# Altium project B100AA.PrjPcb (part 6 of 7)

## Sheet Buzzer.SchDoc: Buzzer
size A4; ApprovedBy: Mehmet Günce Akkoyun; CheckedBy: Mehmet Günce Akkoyun; Author: Mehmet Günce Akkoyun; CompanyName: Ovoo Electronics; DrawnBy: Mehmet Günce Akkoyun; Engineer: Mehmet Günce Akkoyun; Organization: Ovoo Electronics; Address1: Necip Fazıl Mah. Ortaırmak Sok.; Address2: Birgül Apt. No: 19/6; Address3: Meram / Konya; Address4: Turkiye; DocumentNumber: 48; Revision: R06; SheetNumber: 48; SheetTotal: 54
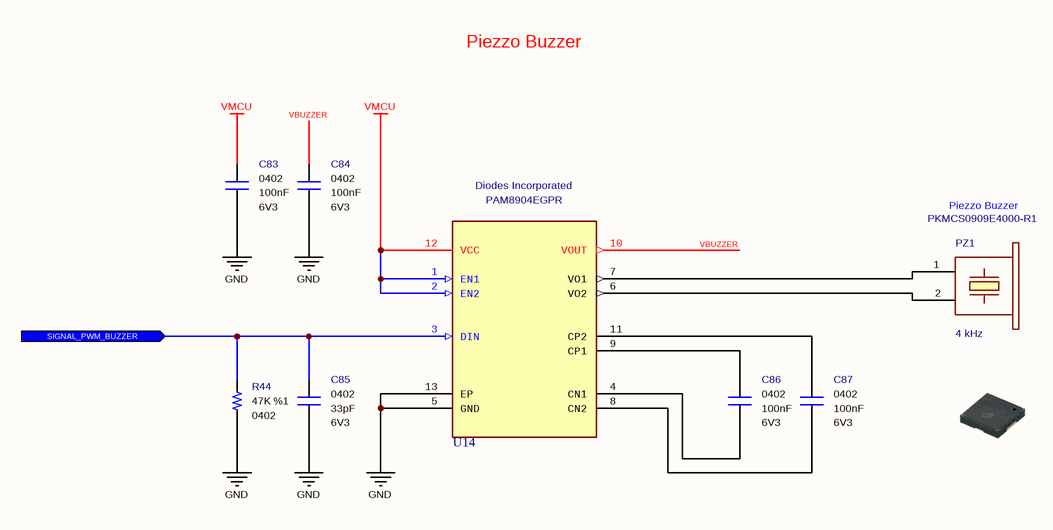
[diagram p55: Buzzer.SchDoc]

### Parts
C83  value 100nF  Case: 0402  Voltage: 6V3  [CAPACITOR_0402]  (hidden comment: Multilayer Ceramic Capacitor)
C84  value 100nF  Case: 0402  Voltage: 6V3  [CAPACITOR_0402]  (hidden comment: Multilayer Ceramic Capacitor)
C85  value 33pF  Case: 0402  Voltage: 6V3  [CAPACITOR_0402]  (hidden comment: Multilayer Ceramic Capacitor)
C86  value 100nF  Case: 0402  Voltage: 6V3  [CAPACITOR_0402]  (hidden comment: Multilayer Ceramic Capacitor)
C87  value 100nF  Case: 0402  Voltage: 6V3  [CAPACITOR_0402]  (hidden comment: Multilayer Ceramic Capacitor)
PZ1  Frequency: 4 kHz  Manufacturer Part Number: PKMCS0909E4000-R1  Device Type: Piezzo Buzzer  [Murata Piezzo Buzzer]  (hidden comment: Piezo Buzzers & Audio Indicators)
R44  value 47K  Tolerance: %1  Case: 0402  [RESISTOR_0402]  (hidden comment: Thick Film Resistor)
U14  Manufacturer Name: Diodes Incorporated  Manufacturer Part Number: PAM8904EGPR  [QFN2020-12]  (hidden comment: Audio Amplifiers)

### Ports
SIGNAL_PWM_BUZZER (in)

### Nets
GND: C83.1 C84.1 C85.1 R44.1 U14.5(GND) U14.13(EP)
VMCU: C83.2 U14.1(EN1) U14.2(EN2) U14.12(VCC)
SIGNAL_PWM_BUZZER: C85.2 R44.2 U14.3(DIN) ; port SIGNAL_PWM_BUZZER
VBUZZER: C84.2 U14.10(VOUT)
NetC86_1: C86.1 U14.4(CN1)
NetC86_2: C86.2 U14.9(CP1)
NetC87_1: C87.1 U14.8(CN2)
NetC87_2: C87.2 U14.11(CP2)
NetPZ1_1: PZ1.1(+) U14.7(VO1)
NetPZ1_2: PZ1.2(-) U14.6(VO2)

### Notes on the sheet
- Piezzo Buzzer
- Engineer
- All Rights are reserved to Customer and Engineer. [2021]
- Size:
- Date:
- A4
- Project :
- Time:
- Sheet
- of
- Customer
- Product ID
- Module ID
- Version
- File:
- Revision

### Library data of the parts
C83 C84 C86 C87 = Capacitor - 100nF [0402-6V3]: Capacitor - 100nF [0402-6V3] (Ceramic); Manufacturer Name: AVX; Manufacturer Part Number: 04026D104KAT4A; Dielectric: X5R; Tolerance: %10; Height: 0.25mm; ComponentLink1Description: Mouser; ComponentLink1URL: https://www.mouser.com.tr/ProductDetail/AVX/04026D104KAT4A?qs=sGAEpiMZZMs0AnBnWHyRQPg4iYkCw7IMED%2F4kpqgf7w%3D; ComponentLink2Description: DataSheet; ComponentLink2URL: https://www.mouser.com.tr/datasheet/2/40/cx5r-776519.pdf; ROHS: Yes; Maximum Operating Temperature: +85; Minimum Operating Temperature: -55; Supplier 1: Avnet; Supplier Part Number 1: 04026D104KAT4A; Mouser Part Number: 581-04026D104KAT4A
C85 = Capacitor - 33pF [0402-6V3]: Capacitor - 33pF [0402] (Ceramic); Manufacturer Name: Kemet; Manufacturer Part Number: C0402C330J9RACAUTO; Dielectric: X7R; Tolerance: 10%; Height: 0.5mm; Maximum Operating Temperature: +125; Minimum Operating Temperature: -55; ROHS: Yes; ComponentLink1Description: DataSheet; ComponentLink1URL: https://api.kemet.com/component-edge/download/datasheet/C0402C330J9RACAUTO.pdf; ComponentLink2Description: Mouser; ComponentLink2URL: https://www.mouser.com/Search/Refine.aspx?Keyword=80-C0402C330J9RAUTO; Supplier 1: Mouser; Supplier Part Number 1: 80-C0402C330J9RAUTO; Mouser Part Number: 80-C0402C330J9RAUTO
PZ1 = Buzzer - PKMCS0909E4000-R1: Piezo Buzzers & Audio Indicators Piezo Buzzer 9x9mm 4KHz 1.9mm Thickness; Manufacturer Name: Murata; Sound Level: 65 dBA; Height: 1.9 mm; ROHS: Yes; ComponentLink1Description: DataSheet; ComponentLink1URL: https://www.mouser.com.tr/datasheet/2/281/PKMCS0909E4000-R1-1186610.pdf; ComponentLink2Description: Mouser; ComponentLink2URL: https://www.mouser.com.tr/ProductDetail/Murata-Electronics/PKMCS0909E4000-R1/?qs=%2Fha2pyFadui1K1i3N8Z4%252B4bkKwHbQN%252BSPuj64PQSz0jmNOq7MpVIpg%3D%3D; Supplier 1: RSComponents; Supplier 2: RSComponents; Supplier 3: Mouser; Supplier 4: Arrow Electronics; Supplier 5: Farnell; Supplier 6: Newark; Supplier 7: Digi-Key; Supplier 8: Digi-Key; Supplier 9: Digi-Key; Supplier Part Number 1: 9010898P; Supplier Part Number 2: 9010898; Supplier Part Number 3: 81-PKMCS0909E4000-R1; Supplier Part Number 4: PKMCS0909E4000-R1; Supplier Part Number 5: 2529461; Supplier Part Number 6: 81Y9719; Supplier Part Number 7: 490-9647-1-ND; Supplier Part Number 8: 490-9647-6-ND; Supplier Part Number 9: 490-9647-2-ND; Mouser Part Number: 81-PKMCS0909E4000-R1; Case: SMD
R44 = Resistor - 47K: Thick Film Resistors - SMD 1/16 W 47 Kohms 1%; Manufacturer Name: Vishay; Manufacturer Part Number: CRCW040247K0FKED; Height: 0.4mm; ComponentLink1Description: DataSheet; ComponentLink1URL: https://www.mouser.com.tr/datasheet/2/427/dcrcwe3-1762152.pdf; ComponentLink2Description: Mouser; ComponentLink2URL: https://www.mouser.com.tr/ProductDetail/Vishay-Dale/CRCW040247K0FKED?qs=sGAEpiMZZMu61qfTUdNhG2DpbjADlD3GL%252B3h1elTxqU%3D; Supplier 1: Mouser; Supplier 2: Digi-Key; Supplier Part Number 1: 71-CRCW040247K0FKEDH; Supplier Part Number 2: 541-47.0KYCT-ND; Mouser Part Number: 71-CRCW0402-47K-E3
U14 = IC - PAM8904EGPR: Audio Amplifiers Audio High Volt; Operating Supply Voltage: 1V5-5V5; ComponentLink1Description: DataSheet; ComponentLink1URL: https://www.diodes.com/assets/Datasheets/PAM8904E.pdf; ComponentLink2Description: Mouser; ComponentLink2URL: https://www.mouser.com.tr/ProductDetail/Diodes-Incorporated/PAM8904EGPR/?qs=EBDBlbfErPxEsxcCuoWH6w%3D%3D; Case: VQFN2020-12; Maximum Operating Temperature: +85; Minimum Operating Temperature: -40; Supplier 1: Avnet; Supplier 2: Mouser; Supplier 3: RSComponents; Supplier 4: Digi-Key; Supplier 5: Digi-Key; Supplier Part Number 1: PAM8904EGPR; Supplier Part Number 2: 621-PAM8904EGPR; Supplier Part Number 3: 2060051; Supplier Part Number 4: 31-PAM8904EGPRCT-ND; Supplier Part Number 5: 31-PAM8904EGPRDKR-ND; Mouser Part Number: 621-PAM8904EGPR

## Sheet Master MicroController LED.SchDoc: Master MicroController LED
size A4; ApprovedBy: Mehmet Günce Akkoyun; CheckedBy: Mehmet Günce Akkoyun; Author: Mehmet Günce Akkoyun; CompanyName: Ovoo Electronics; DrawnBy: Mehmet Günce Akkoyun; Engineer: Mehmet Günce Akkoyun; Organization: Ovoo Electronics; Address1: Necip Fazıl Mah. Ortaırmak Sok.; Address2: Birgül Apt. No: 19/6; Address3: Meram / Konya; Address4: Turkiye; DocumentNumber: 28; Revision: R06; SheetNumber: 28; SheetTotal: 54
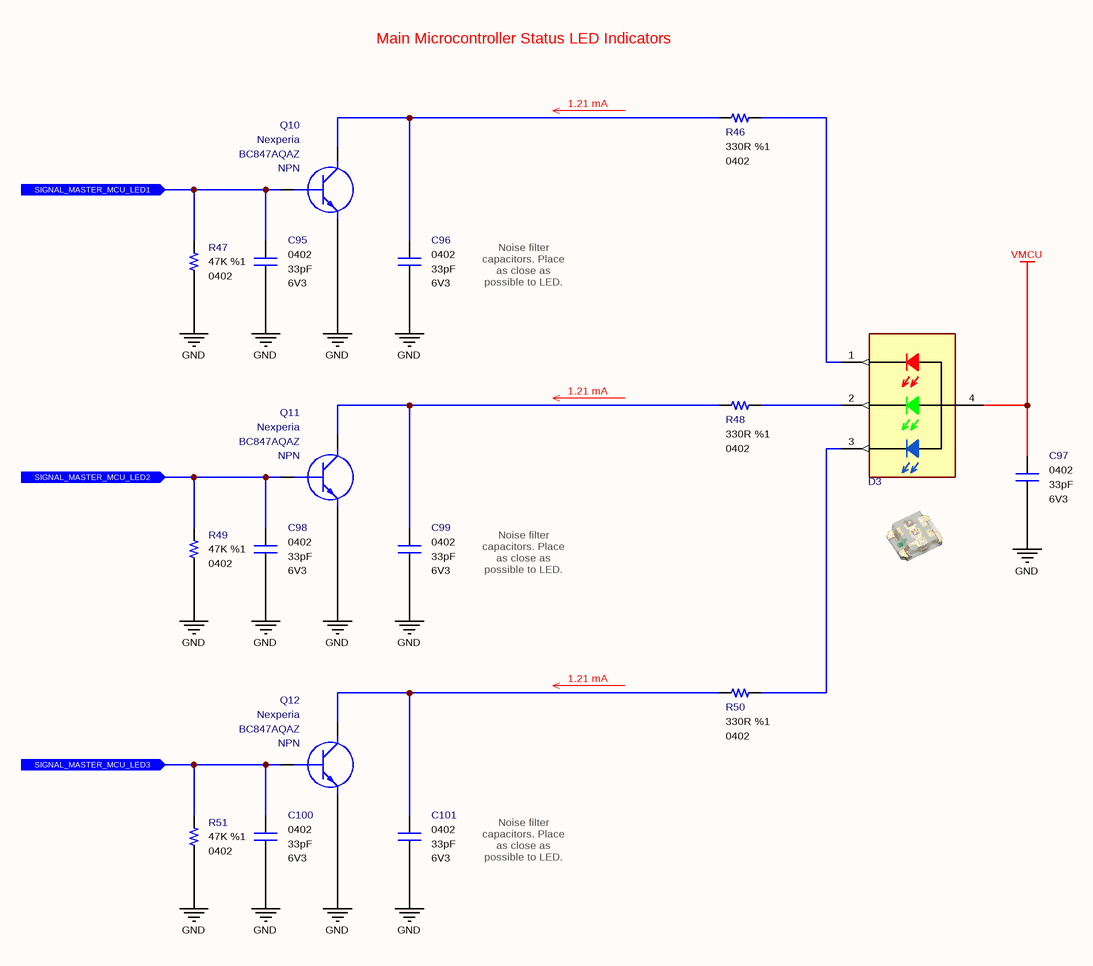
[diagram p56: Master MicroController LED.SchDoc]

### Parts
C95  value 33pF  Case: 0402  Voltage: 6V3  [CAPACITOR_0402]  (hidden comment: Multilayer Ceramic Capacitor)
C96  value 33pF  Case: 0402  Voltage: 6V3  [CAPACITOR_0402]  (hidden comment: Multilayer Ceramic Capacitor)
C97  value 33pF  Case: 0402  Voltage: 6V3  [CAPACITOR_0402]  (hidden comment: Multilayer Ceramic Capacitor)
C98  value 33pF  Case: 0402  Voltage: 6V3  [CAPACITOR_0402]  (hidden comment: Multilayer Ceramic Capacitor)
C99  value 33pF  Case: 0402  Voltage: 6V3  [CAPACITOR_0402]  (hidden comment: Multilayer Ceramic Capacitor)
C100  value 33pF  Case: 0402  Voltage: 6V3  [CAPACITOR_0402]  (hidden comment: Multilayer Ceramic Capacitor)
C101  value 33pF  Case: 0402  Voltage: 6V3  [CAPACITOR_0402]  (hidden comment: Multilayer Ceramic Capacitor)
D3  150066M153000  [Wurth_0606]  (value not drawn)
Q10  Manufacturer_Name: Nexperia  Manufacturer_Part_Number: BC847AQAZ  Polarity: NPN  [SOT1215]  (hidden comment: Bipolar NPN Transistors)
Q11  Manufacturer_Name: Nexperia  Manufacturer_Part_Number: BC847AQAZ  Polarity: NPN  [SOT1215]  (hidden comment: Bipolar NPN Transistors)
Q12  Manufacturer_Name: Nexperia  Manufacturer_Part_Number: BC847AQAZ  Polarity: NPN  [SOT1215]  (hidden comment: Bipolar NPN Transistors)
R46  value 330R  Tolerance: %1  Case: 0402  [RESISTOR_0402]  (hidden comment: Thick Film Resistor)
R47  value 47K  Tolerance: %1  Case: 0402  [RESISTOR_0402]  (hidden comment: Thick Film Resistor)
R48  value 330R  Tolerance: %1  Case: 0402  [RESISTOR_0402]  (hidden comment: Thick Film Resistor)
R49  value 47K  Tolerance: %1  Case: 0402  [RESISTOR_0402]  (hidden comment: Thick Film Resistor)
R50  value 330R  Tolerance: %1  Case: 0402  [RESISTOR_0402]  (hidden comment: Thick Film Resistor)
R51  value 47K  Tolerance: %1  Case: 0402  [RESISTOR_0402]  (hidden comment: Thick Film Resistor)

### Ports
SIGNAL_MASTER_MCU_LED1 (in), SIGNAL_MASTER_MCU_LED2 (in), SIGNAL_MASTER_MCU_LED3 (in)

### Nets
GND: C95.2 C96.2 C97.2 C98.2 C99.2 C100.2 C101.2 Q10.2(E) Q11.2(E) Q12.2(E) R47.1 R49.1 R51.1
VMCU: C97.1 D3.4
SIGNAL_MASTER_MCU_LED1: C95.1 Q10.1(B) R47.2 ; port SIGNAL_MASTER_MCU_LED1
SIGNAL_MASTER_MCU_LED2: C98.1 Q11.1(B) R49.2 ; port SIGNAL_MASTER_MCU_LED2
SIGNAL_MASTER_MCU_LED3: C100.1 Q12.1(B) R51.2 ; port SIGNAL_MASTER_MCU_LED3
NetC96_1: C96.1 Q10.3(C) R46.1
NetC99_1: C99.1 Q11.3(C) R48.1
NetC101_1: C101.1 Q12.3(C) R50.1
NetD3_1: D3.1 R46.2
NetD3_2: D3.2 R48.2
NetD3_3: D3.3 R50.2

### Notes on the sheet
- Main Microcontroller Status LED Indicators
- 1.21 mA
- Noise filter capacitors. Place as close as possible to LED.
- Engineer
- All Rights are reserved to Customer and Engineer. [2021]
- Size:
- Date:
- A4
- Project :
- Time:
- Sheet
- of
- Customer
- Product ID
- Module ID
- Version
- File:
- Revision

### Library data of the parts
C95-C101 = Capacitor - 33pF [0402-6V3]: as C85 on sheet Buzzer; Height: 0.5mm; Maximum Operating Temperature: +125; Minimum Operating Temperature: -55; ROHS: Yes; ComponentLink1Description: DataSheet; ComponentLink1URL: https://api.kemet.com/component-edge/download/datasheet/C0402C330J9RACAUTO.pdf; ComponentLink2Description: Mouser; ComponentLink2URL: https://www.mouser.com/Search/Refine.aspx?Keyword=80-C0402C330J9RAUTO; Supplier 1: Mouser; Supplier Part Number 1: 80-C0402C330J9RAUTO; Mouser Part Number: 80-C0402C330J9RAUTO
D3 = Diode - RGB LED (150066M153000): Standard LEDs - SMD PICOLED series Red LED; Manufacturer Name: Wurth Elektronik; Datasheet Link: https://www.mouser.com.tr/datasheet/2/445/150066M153000-1715259.pdf; Manufacturer Part Number: 150066M153000; Mouser Part Number: 710-150066M153000; Mouser Price/Stock: https://www.mouser.com.tr/ProductDetail/ROHM-Semiconductor/SML-P12U2TT86R?qs=sGAEpiMZZMseGfSY3csMkRIBDsfU3UCXJTULB5gem9Ta%252Bp%252BvZ709fg%3D%3D; Case: 0606; ROHS: Yes; Supplier 1: RSComponents; Supplier 2: RSComponents; Supplier 3: Mouser; Supplier 4: Farnell; Supplier 5: Digi-Key; Supplier 6: Digi-Key; Supplier 7: Digi-Key; Supplier 8: Newark; Supplier Part Number 1: 1765006; Supplier Part Number 2: 1766050; Supplier Part Number 3: 710-150066M153000; Supplier Part Number 4: 2764964; Supplier Part Number 5: 732-11390-1-ND; Supplier Part Number 6: 732-11390-6-ND; Supplier Part Number 7: 732-11390-2-ND; Supplier Part Number 8: 22AC3253
Q10-Q12 = Transistor - BC847: Bipolar Transistors - BJT BC847AQA/DFN1010D-3/REEL 7" Q2; Mouser_Part_Number: 771-BC847AQAZ; ComponentLink1Description: DataSheet; ComponentLink1URL: https://www.mouser.com.tr/datasheet/2/916/BC847XQA_SER-1598405.pdf; ComponentLink2Description: Mouser; ComponentLink2URL: https://www.mouser.com.tr/ProductDetail/Nexperia/BC847AQAZ?qs=%2Fha2pyFaduhKMCPKNtQimeJpXTw9z4AqURd2YARs8DVICZNv3AT9Dw%3D%3D; Case: DFN-1010D-3; Supplier 1: Mouser; Supplier 2: Digi-Key; Supplier Part Number 1: 771-BC847AQAZ; Supplier Part Number 2: 1727-2545-1-ND
R46 R48 R50 = Resistor - 330R: Thick Film Resistors - SMD 1/16 W 330 Ohm 1%; Manufacturer Name: Vishay; Manufacturer Part Number: CRCW0402330RFKED; Height: 0.4mm; ComponentLink1Description: DataSheet; ComponentLink1URL: https://www.mouser.com.tr/datasheet/2/427/dcrcwe3-1762152.pdf; ComponentLink2Description: Mouser; ComponentLink2URL: https://www.mouser.com.tr/ProductDetail/Vishay-Dale/CRCW0402330RFKED?qs=sGAEpiMZZMu61qfTUdNhG2DpbjADlD3GGS6SwBlLi5Q%3D; Supplier 1: Mouser; Supplier 2: Digi-Key; Supplier Part Number 2: 541-330LCT-ND; Supplier Part Number 1: 71-CRCW0402-330-E3; Mouser Part Number: 71-CRCW0402-330-E3
R47 R49 R51 = Resistor - 47K: as R44 on sheet Buzzer; Height: 0.4mm; ComponentLink1Description: DataSheet; ComponentLink1URL: https://www.mouser.com.tr/datasheet/2/427/dcrcwe3-1762152.pdf; ComponentLink2Description: Mouser; ComponentLink2URL: https://www.mouser.com.tr/ProductDetail/Vishay-Dale/CRCW040247K0FKED?qs=sGAEpiMZZMu61qfTUdNhG2DpbjADlD3GL%252B3h1elTxqU%3D; Supplier 1: Mouser; Supplier 2: Digi-Key; Supplier Part Number 1: 71-CRCW040247K0FKEDH; Supplier Part Number 2: 541-47.0KYCT-ND; Mouser Part Number: 71-CRCW0402-47K-E3

## Sheet I2C Network.SchDoc: I2C Network Block Diagram
size A3; ApprovedBy: Mehmet Günce Akkoyun; CheckedBy: Mehmet Günce Akkoyun; Author: Mehmet Günce Akkoyun; CompanyName: Ovoo Electronics; DrawnBy: Mehmet Günce Akkoyun; Engineer: Mehmet Günce Akkoyun; Organization: Ovoo Electronics; Address1: Necip Fazıl Mah. Ortaırmak Sok.; Address2: Birgül Apt. No: 19/6; Address3: Meram / Konya; Address4: Turkiye; DocumentNumber: 49; Revision: R06; SheetNumber: 49; SheetTotal: 54
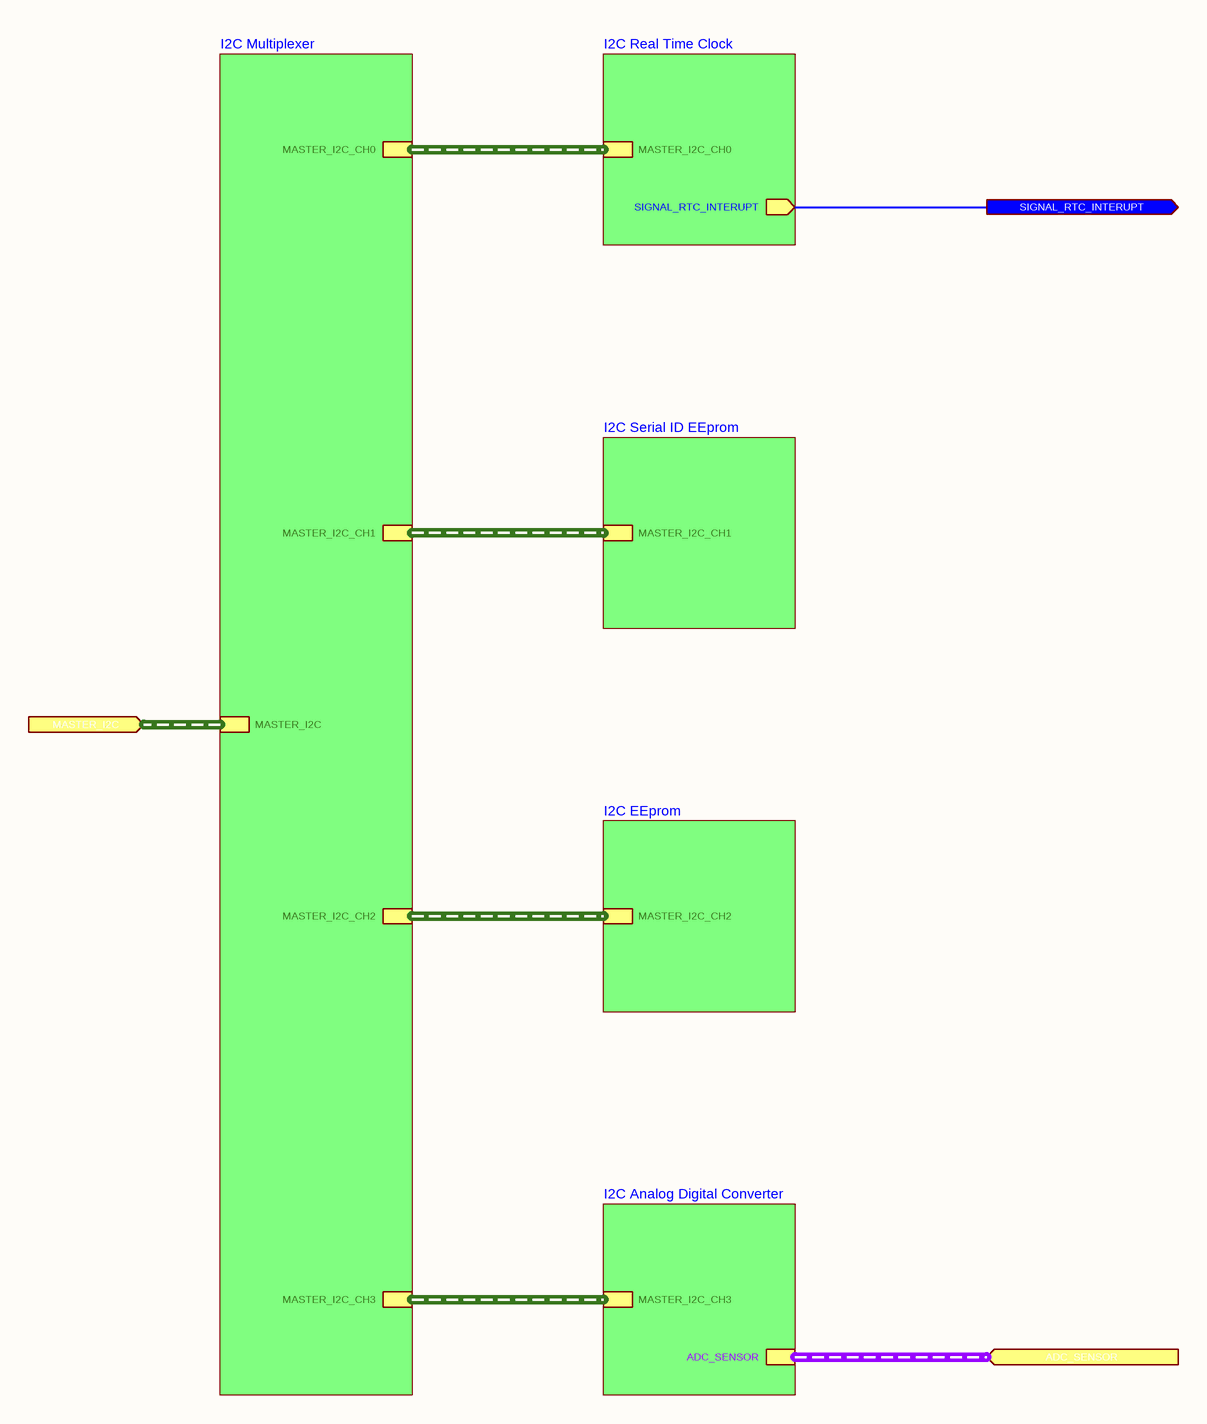
[diagram p57: I2C Network.SchDoc]

### Sub-sheets
I2C Analog Digital Converter = Analog Digital Converter.SchDoc: MASTER_I2C_CH3 (harness MASTER_I2C_CH3), ADC_SENSOR (harness ADC_SENSOR)
I2C EEprom = EEPROM.SchDoc: MASTER_I2C_CH2 (harness MASTER_I2C_CH2)
I2C Multiplexer = I2C Multiplexer.SchDoc: MASTER_I2C_CH1 (harness MASTER_I2C_CH1), MASTER_I2C_CH2 (harness MASTER_I2C_CH2), MASTER_I2C_CH3 (harness MASTER_I2C_CH3), MASTER_I2C_CH0 (harness MASTER_I2C_CH0), MASTER_I2C (harness MASTER_I2C)
I2C Real Time Clock = Real Time Clock.SchDoc: SIGNAL_RTC_INTERUPT (out), MASTER_I2C_CH0 (harness MASTER_I2C_CH0)
I2C Serial ID EEprom = Serial ID EEPROM.SchDoc: MASTER_I2C_CH1 (harness MASTER_I2C_CH1)

### Ports
ADC_SENSOR (in, harness ADC_SENSOR), MASTER_I2C (in, harness MASTER_I2C), SIGNAL_RTC_INTERUPT (out)

### Nets
SIGNAL_RTC_INTERUPT: port SIGNAL_RTC_INTERUPT, sheet I2C Real Time Clock/SIGNAL_RTC_INTERUPT

### Buses and harness runs
harness port ADC_SENSOR = sheet I2C Analog Digital Converter/ADC_SENSOR
harness port MASTER_I2C = sheet I2C Multiplexer/MASTER_I2C
harness sheet I2C Analog Digital Converter/MASTER_I2C_CH3 = sheet I2C Multiplexer/MASTER_I2C_CH3
harness sheet I2C EEprom/MASTER_I2C_CH2 = sheet I2C Multiplexer/MASTER_I2C_CH2
harness sheet I2C Multiplexer/MASTER_I2C_CH0 = sheet I2C Real Time Clock/MASTER_I2C_CH0
harness sheet I2C Multiplexer/MASTER_I2C_CH1 = sheet I2C Serial ID EEprom/MASTER_I2C_CH1

### Notes on the sheet
- Title
- Size:
- Date:
- A3
- Number:
- Time:
- Revision:
- Sheet
- of
- File:

## Sheet I2C Multiplexer.SchDoc: I2C Multiplexer
size A4; ApprovedBy: Mehmet Günce Akkoyun; CheckedBy: Mehmet Günce Akkoyun; Author: Mehmet Günce Akkoyun; CompanyName: Ovoo Electronics; DrawnBy: Mehmet Günce Akkoyun; Engineer: Mehmet Günce Akkoyun; Organization: Ovoo Electronics; Address1: Necip Fazıl Mah. Ortaırmak Sok.; Address2: Birgül Apt. No: 19/6; Address3: Meram / Konya; Address4: Turkiye; DocumentNumber: 50; Revision: R06; SheetNumber: 50; SheetTotal: 54
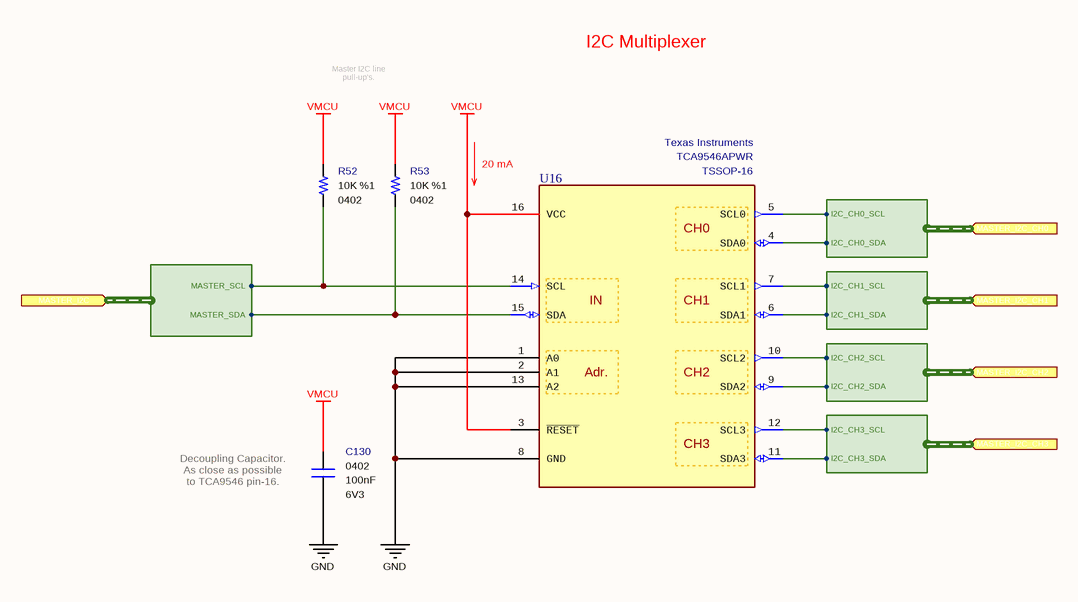
[diagram p58: I2C Multiplexer.SchDoc]

### Parts
C130  value 100nF  Case: 0402  Voltage: 6V3  [CAPACITOR_0402]  (hidden comment: Multilayer Ceramic Capacitor)
R52  value 10K  Tolerance: %1  Case: 0402  [RESISTOR_0402]  (hidden comment: Thick Film Resistor)
R53  value 10K  Tolerance: %1  Case: 0402  [RESISTOR_0402]  (hidden comment: Thick Film Resistor)
U16  Manufacturer Part Number: TCA9546APWR  Manufacturer Name: Texas Instruments  [TSSOP-16]  (hidden comment: I2C Switch IC)

### Ports
MASTER_I2C (in, harness MASTER_I2C), MASTER_I2C_CH0 (in, harness MASTER_I2C_CH0), MASTER_I2C_CH1 (in, harness MASTER_I2C_CH1), MASTER_I2C_CH2 (in, harness MASTER_I2C_CH2), MASTER_I2C_CH3 (in, harness MASTER_I2C_CH3)

### Harnesses
MASTER_I2C: MASTER_SDA, MASTER_SCL
MASTER_I2C_CH0: I2C_CH0_SCL, I2C_CH0_SDA
MASTER_I2C_CH1: I2C_CH1_SCL, I2C_CH1_SDA
MASTER_I2C_CH2: I2C_CH2_SCL, I2C_CH2_SDA
MASTER_I2C_CH3: I2C_CH3_SCL, I2C_CH3_SDA

### Nets
GND: C130.1 U16.1(A0) U16.2(A1) U16.8(GND) U16.13(A2)
VMCU: C130.2 R52.2 R53.2 U16.3(~{RESET}) U16.16(VCC)
MASTER_I2C.MASTER_SCL: R52.1 U16.14(SCL) ; port MASTER_I2C.MASTER_SCL
MASTER_I2C.MASTER_SDA: R53.1 U16.15(SDA) ; port MASTER_I2C.MASTER_SDA
NetR54_1: U16.5(SCL0) ; port MASTER_I2C_CH0.I2C_CH0_SCL
NetR55_1: U16.4(SDA0) ; port MASTER_I2C_CH0.I2C_CH0_SDA
NetR58_1: U16.7(SCL1) ; port MASTER_I2C_CH1.I2C_CH1_SCL
NetR59_1: U16.6(SDA1) ; port MASTER_I2C_CH1.I2C_CH1_SDA
NetR60_1: U16.10(SCL2) ; port MASTER_I2C_CH2.I2C_CH2_SCL
NetR61_1: U16.9(SDA2) ; port MASTER_I2C_CH2.I2C_CH2_SDA
NetR62_1: U16.12(SCL3) ; port MASTER_I2C_CH3.I2C_CH3_SCL
NetR63_1: U16.11(SDA3) ; port MASTER_I2C_CH3.I2C_CH3_SDA

### Notes on the sheet
- I2C Multiplexer
- Master I2C line pull-up's.
- (near U16) 20 mA
- (near C130) Decoupling Capacitor. As close as possible to TCA9546 pin-16.
- Engineer
- All Rights are reserved to Customer and Engineer. [2021]
- Size:
- Date:
- A4
- Project :
- Time:
- Sheet
- of
- Customer
- Product ID
- Module ID
- Version
- File:
- Revision
- (in symbol IC - TCA9546APWR) CH0; IN; CH1; Adr.; CH2; CH3

### Library data of the parts
C130 = Capacitor - 100nF [0402-6V3]: as C83 on sheet Buzzer; Height: 0.25mm; ComponentLink1Description: Mouser; ComponentLink1URL: https://www.mouser.com.tr/ProductDetail/AVX/04026D104KAT4A?qs=sGAEpiMZZMs0AnBnWHyRQPg4iYkCw7IMED%2F4kpqgf7w%3D; ComponentLink2Description: DataSheet; ComponentLink2URL: https://www.mouser.com.tr/datasheet/2/40/cx5r-776519.pdf; ROHS: Yes; Maximum Operating Temperature: +85; Minimum Operating Temperature: -55; Supplier 1: Avnet; Supplier Part Number 1: 04026D104KAT4A; Mouser Part Number: 581-04026D104KAT4A
R52 R53 = Resistor - 10K: as R38-R41 on sheet SD Card; Height: 0.4mm; ComponentLink1Description: DataSheet; ComponentLink1URL: https://www.mouser.com.tr/datasheet/2/427/dcrcwe3-1762152.pdf; ComponentLink2Description: Mouser; ComponentLink2URL: https://www.mouser.com.tr/ProductDetail/Vishay-Dale/CRCW040210K0FKED?qs=sGAEpiMZZMu61qfTUdNhG2DpbjADlD3GcalbOv9utCY%3D; Supplier 1: Mouser; Supplier 2: Digi-Key; Supplier Part Number 1: 71-CRCW040210K0FKEDH; Supplier Part Number 2: 541-10.0KYCT-ND; Mouser Part Number: 71-CRCW0402-10K-E3
U16 = IC - TCA9546APWR: Switch ICs - Various 4-Channel I2C and SMBus; Mouser Part Number: 595-TCA9546APWR; ComponentLink1Description: DataSheet; ComponentLink1URL: http://www.ti.com/lit/ds/symlink/tca9546a.pdf; ComponentLink2Description: Mouser; ComponentLink2URL: https://eu.mouser.com/ProductDetail/Texas-Instruments/TCA9546APWR?qs=sGAEpiMZZMu0f%252BT2bkVfuqY85%252BzcFu6eZaMCXRqwDMg%3D; Minimum Operating Temperature: -40; Maximum Operating Temperature: +85; Supplier 1: Mouser; Supplier 2: Farnell; Supplier 3: Newark; Supplier 4: Digi-Key; Supplier Part Number 1: 595-TCA9546APWR; Supplier Part Number 2: 3006768; Supplier Part Number 3: 28AH5268; Supplier Part Number 4: 296-40578-1-ND; Case: TSSOP-16

## Sheet Real Time Clock.SchDoc: I2C Real Time Clock
size A4; ApprovedBy: Mehmet Günce Akkoyun; CheckedBy: Mehmet Günce Akkoyun; Author: Mehmet Günce Akkoyun; CompanyName: Ovoo Electronics; DrawnBy: Mehmet Günce Akkoyun; Engineer: Mehmet Günce Akkoyun; Organization: Ovoo Electronics; Address1: Necip Fazıl Mah. Ortaırmak Sok.; Address2: Birgül Apt. No: 19/6; Address3: Meram / Konya; Address4: Turkiye; DocumentNumber: 51; Revision: R06; SheetNumber: 51; SheetTotal: 54
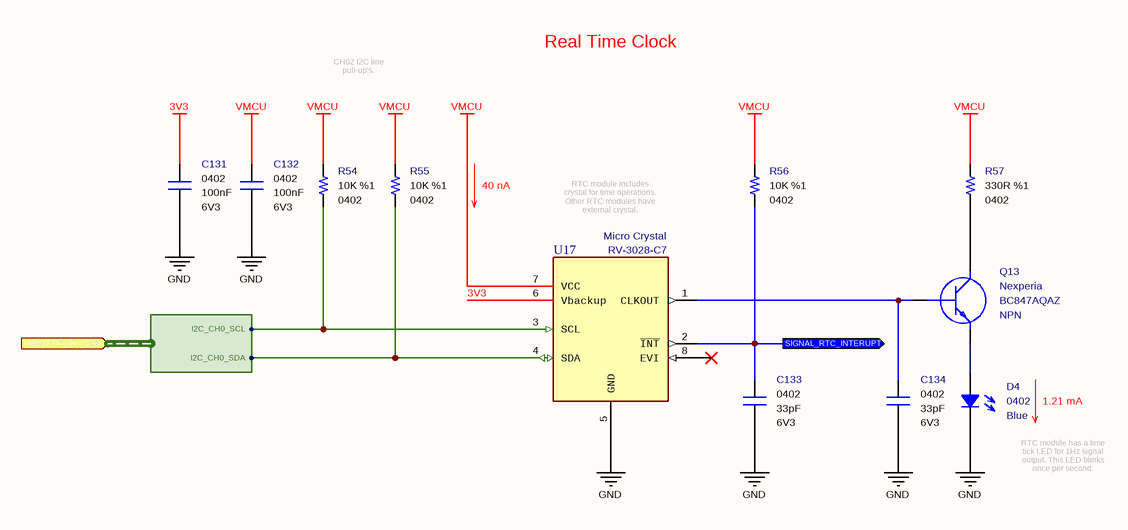
[diagram p59: Real Time Clock.SchDoc]

### Parts
C131  value 100nF  Case: 0402  Voltage: 6V3  [CAPACITOR_0402]  (hidden comment: Multilayer Ceramic Capacitor)
C132  value 100nF  Case: 0402  Voltage: 6V3  [CAPACITOR_0402]  (hidden comment: Multilayer Ceramic Capacitor)
C133  value 33pF  Case: 0402  Voltage: 6V3  [CAPACITOR_0402]  (hidden comment: Multilayer Ceramic Capacitor)
C134  value 33pF  Case: 0402  Voltage: 6V3  [CAPACITOR_0402]  (hidden comment: Multilayer Ceramic Capacitor)
D4  Case: 0402  Color: Blue  [LED_0402]  (hidden comment: SMD LED (Blue))
Q13  Polarity: NPN  Manufacturer Name: Nexperia  [SOT1215]  (hidden comment: BC847AQAZ)
R54  value 10K  Tolerance: %1  Case: 0402  [RESISTOR_0402]  (hidden comment: Thick Film Resistor)
R55  value 10K  Tolerance: %1  Case: 0402  [RESISTOR_0402]  (hidden comment: Thick Film Resistor)
R56  value 10K  Tolerance: %1  Case: 0402  [RESISTOR_0402]  (hidden comment: Thick Film Resistor)
R57  value 330R  Tolerance: %1  Case: 0402  [RESISTOR_0402]  (hidden comment: 330R - 0402 - %1 - 1/16W)
U17  Manufacturer Name: Micro Crystal  [RV-3028-C7]  (hidden comment: Real Time Clock)

### Ports
MASTER_I2C_CH0 (in, harness MASTER_I2C_CH0), SIGNAL_RTC_INTERUPT (out)

### Harnesses
MASTER_I2C_CH0: I2C_CH0_SDA, I2C_CH0_SCL

### Nets
3V3: C131.2 U17.6(Vbackup)
GND: C131.1 C132.1 C133.2 C134.2 D4.1 U17.5(GND)
VMCU: C132.2 R54.2 R55.2 R56.2 R57.2 U17.7(VCC)
SIGNAL_RTC_INTERUPT: C133.1 R56.1 U17.2(~{INT}) ; port SIGNAL_RTC_INTERUPT
NetC134_1: C134.1 Q13.1(B) U17.1(CLKOUT)
NetD4_2: D4.2 Q13.2(E)
NetQ13_3: Q13.3(C) R57.1
NetR54_1: R54.1 U17.3(SCL) ; port MASTER_I2C_CH0.I2C_CH0_SCL
NetR55_1: R55.1 U17.4(SDA) ; port MASTER_I2C_CH0.I2C_CH0_SDA

Not connected (* = marked no-connect by the designer): U17 8(EVI)*

### Notes on the sheet
- Real Time Clock
- CH02 I2C line pull-up's.
- 40 nA
- RTC module includes crystal for time operations. Other RTC modules have external crystal.
- 1.21 mA
- RTC module has a time tick LED for 1Hz signal output. This LED blinks once per second.
- Engineer
- All Rights are reserved to Customer and Engineer. [2021]
- Size:
- Date:
- A4
- Project :
- Time:
- Sheet
- of
- Customer
- Product ID
- Module ID
- Version
- File:
- Revision

### Library data of the parts
C131 C132 = Capacitor - 100nF [0402-6V3]: as C83 on sheet Buzzer; Height: 0.25mm; ComponentLink1Description: Mouser; ComponentLink1URL: https://www.mouser.com.tr/ProductDetail/AVX/04026D104KAT4A?qs=sGAEpiMZZMs0AnBnWHyRQPg4iYkCw7IMED%2F4kpqgf7w%3D; ComponentLink2Description: DataSheet; ComponentLink2URL: https://www.mouser.com.tr/datasheet/2/40/cx5r-776519.pdf; ROHS: Yes; Maximum Operating Temperature: +85; Minimum Operating Temperature: -55; Supplier 1: Avnet; Supplier Part Number 1: 04026D104KAT4A; Mouser Part Number: 581-04026D104KAT4A
C133 C134 = Capacitor - 33pF [0402-6V3]: as C85 on sheet Buzzer; Height: 0.5mm; Maximum Operating Temperature: +125; Minimum Operating Temperature: -55; ROHS: Yes; ComponentLink1Description: DataSheet; ComponentLink1URL: https://api.kemet.com/component-edge/download/datasheet/C0402C330J9RACAUTO.pdf; ComponentLink2Description: Mouser; ComponentLink2URL: https://www.mouser.com/Search/Refine.aspx?Keyword=80-C0402C330J9RAUTO; Supplier 1: Mouser; Supplier Part Number 1: 80-C0402C330J9RAUTO; Mouser Part Number: 80-C0402C330J9RAUTO
D4 = Diode - LED (0402-Blue): Standard LEDs - SMD PICOLEDTM;BLUE LED; 25M @ 5MA; Manufacturer Name: ROHM Semiconductor; Manufacturer Part Number: SMLP13BC8TT86; ROHS: Yes; ComponentLink1Description: DataSheet; ComponentLink1URL: https://d1d2qsbl8m0m72.cloudfront.net/en/products/databook/datasheet/opto/led/chip_mono/sml-p1-e.pdf; ComponentLink2Description: Mouser; ComponentLink2URL: https://www.mouser.com.tr/ProductDetail/ROHM-Semiconductor/SMLP13BC8TT86?qs=%2Fha2pyFaduidYDgXFKL%252BNZwCVZNUI4FlyPWWbVDx1b6ABmzS%252BS2f0w%3D%3D; Supplier 1: Mouser; Supplier 2: Digi-Key; Supplier Part Number 1: 755-SMLP13BC8TT86; Supplier Part Number 2: 846-1112-1-ND; Mouser Part Number: 755-SMLP13BC8TT86
Q13 = Transistor - BC847: Bipolar NPN Transistors; Case: DFN-1010D-3; Supplier 1: Digi-Key; Supplier 2: Digi-Key; Supplier Part Number 1: 1727-2545-1-ND; Supplier Part Number 2: 1727-2545-6-ND; Manufacturer Part Number: BC847AQAZ; Supplier 3: Avnet; Supplier 4: Arrow Electronics; Supplier 5: Mouser; Supplier 6: Newark; Supplier 7: Digi-Key; Supplier 8: Farnell; Supplier 9: Farnell; Supplier Part Number 3: BC847AQAZ; Supplier Part Number 4: BC847AQAZ; Supplier Part Number 5: 771-BC847AQAZ; Supplier Part Number 6: 82Y6125; Supplier Part Number 7: 1727-2545-2-ND; Supplier Part Number 8: 2545344; Supplier Part Number 9: 2545344RL
R54-R56 = Resistor - 10K: as R38-R41 on sheet SD Card; Height: 0.4mm; ComponentLink1Description: DataSheet; ComponentLink1URL: https://www.mouser.com.tr/datasheet/2/427/dcrcwe3-1762152.pdf; ComponentLink2Description: Mouser; ComponentLink2URL: https://www.mouser.com.tr/ProductDetail/Vishay-Dale/CRCW040210K0FKED?qs=sGAEpiMZZMu61qfTUdNhG2DpbjADlD3GcalbOv9utCY%3D; Supplier 1: Mouser; Supplier 2: Digi-Key; Supplier Part Number 1: 71-CRCW040210K0FKEDH; Supplier Part Number 2: 541-10.0KYCT-ND; Mouser Part Number: 71-CRCW0402-10K-E3
R57 = Resistor - 330R: as R46 on sheet Master MicroController LED; Height: 0.4mm; ComponentLink1Description: DataSheet; ComponentLink1URL: https://www.mouser.com.tr/datasheet/2/427/dcrcwe3-1762152.pdf; ComponentLink2Description: Mouser; ComponentLink2URL: https://www.mouser.com.tr/ProductDetail/Vishay-Dale/CRCW0402330RFKED?qs=sGAEpiMZZMu61qfTUdNhG2DpbjADlD3GGS6SwBlLi5Q%3D; Supplier 1: Digi-Key; Supplier 2: Digi-Key; Supplier Part Number 2: 541-330LDKR-ND; Supplier Part Number 1: 541-330LCT-ND; Mouser Part Number: 71-CRCW0402-330-E3; Supplier 3: Digi-Key; Supplier 4: Newark; Supplier 5: Newark; Supplier 6: RSComponents; Supplier 7: RSComponents; Supplier 8: Future Electronics; Supplier 9: Future Electronics; Supplier 10: Newark; Supplier 11: Newark; Supplier 12: Arrow Electronics; Supplier 13: Mouser; Supplier 14: Avnet; Supplier 15: Farnell; Supplier 16: Farnell; Supplier 17: Farnell; Supplier 18: Allied Electronics; Supplier 19: Allied Electronics; Supplier 20: Avnet; Supplier 21: Avnet; Supplier 22: Future Electronics; Supplier 23: Future Electronics; Supplier 24: Newark; Supplier 25: RSComponents; Supplier 26: RSComponents; Supplier Part Number 3: 541-330LTR-ND; Supplier Part Number 4: 52K6981; Supplier Part Number 5: 61M5301; Supplier Part Number 6: 6789178P; Supplier Part Number 7: 6789178; Supplier Part Number 9: 9848185; Supplier Part Number 8: 4103726; Supplier Part Number 10: 25AC7117; Supplier Part Number 11: 42K3473; Supplier Part Number 26: 1819488; Supplier Part Number 25: 1688408; Supplier Part Number 24: 24W2220; Supplier Part Number 23: CRCW0402330RFKED-REEL; Supplier Part Number 22: CRCW0402330RFKED-CUTT; Supplier Part Number 21: 52K6981; Supplier Part Number 20: 42K3473; Supplier Part Number 19: 70272759; Supplier Part Number 18: 70202255; Supplier Part Number 17: 1469709RL; Supplier Part Number 16: 2121540; Supplier Part Number 15: 1469709; Supplier Part Number 14: CRCW0402330RFKED; Supplier Part Number 13: 71-CRCW0402-330-E3; Supplier Part Number 12: CRCW0402330RFKED
U17 = IC - RV-3028-C7: Real Time Clock 32.768kHz I2C Time Acc. 1ppm; ComponentLink1Description: DataSheet; ComponentLink1URL: https://eu.mouser.com/datasheet/2/530/RV-3028-C7-1524919.pdf; ComponentLink2Description: Mouser; ComponentLink2URL: https://eu.mouser.com/ProductDetail/Micro-Crystal/RV-3028-C7-32768kHz-1ppm-TA-QC?qs=sGAEpiMZZMtpeOq%2F1QMb1b6mUOvJOzpDTOpQRtK3%252B9k%3D; Minimum Operating Temperature: -40; Maximum Operating Temperature: +85; Supplier 1: Digi-Key; Supplier Part Number 1: 2195-RV-3028-C732.768KHZ1PPM-TA-QCCT-ND; Case: SMD; Mouser Part Number: 428-203591-MG01; Manufacturer Part Number: RV-3028-C7

## Sheet Serial ID EEPROM.SchDoc: I2C Serial ID EEprom
size A4; ApprovedBy: Mehmet Günce Akkoyun; CheckedBy: Mehmet Günce Akkoyun; Author: Mehmet Günce Akkoyun; CompanyName: Ovoo Electronics; DrawnBy: Mehmet Günce Akkoyun; Engineer: Mehmet Günce Akkoyun; Organization: Ovoo Electronics; Address1: Necip Fazıl Mah. Ortaırmak Sok.; Address2: Birgül Apt. No: 19/6; Address3: Meram / Konya; Address4: Turkiye; DocumentNumber: 52; Revision: R06; SheetNumber: 52; SheetTotal: 54
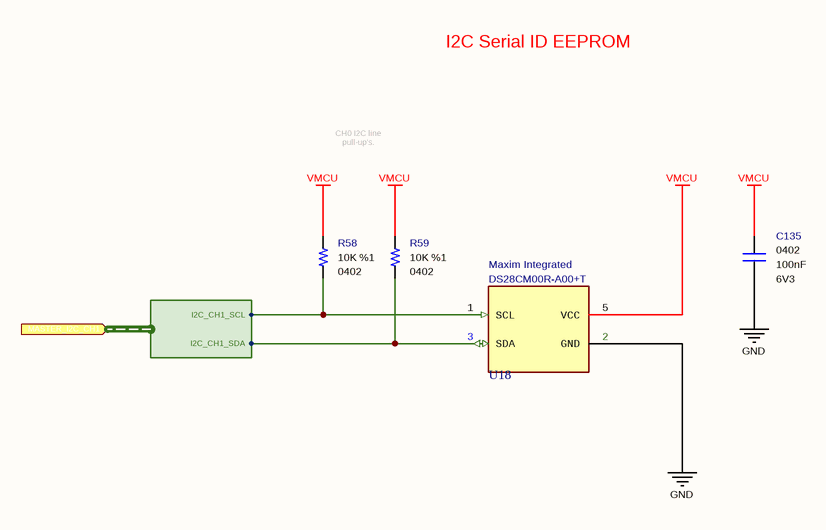
[diagram p60: Serial ID EEPROM.SchDoc]

### Parts
C135  value 100nF  Case: 0402  Voltage: 6V3  [CAPACITOR_0402]  (hidden comment: Multilayer Ceramic Capacitor)
R58  value 10K  Tolerance: %1  Case: 0402  [RESISTOR_0402]  (hidden comment: Thick Film Resistor)
R59  value 10K  Tolerance: %1  Case: 0402  [RESISTOR_0402]  (hidden comment: Thick Film Resistor)
U18  Manufacturer Part Number: DS28CM00R-A00+T  Manufacturer Name: Maxim Integrated  [SOT-23-5]  (hidden comment: Security ICs / Authentication ICs)

### Ports
MASTER_I2C_CH1 (in, harness MASTER_I2C_CH1)

### Harnesses
MASTER_I2C_CH1: I2C_CH1_SDA, I2C_CH1_SCL

### Nets
GND: C135.1 U18.2(GND)
VMCU: C135.2 R58.2 R59.2 U18.5(VCC)
NetR58_1: R58.1 U18.1(SCL) ; port MASTER_I2C_CH1.I2C_CH1_SCL
NetR59_1: R59.1 U18.3(SDA) ; port MASTER_I2C_CH1.I2C_CH1_SDA

Not connected (* = marked no-connect by the designer): U18 4(NC)

### Notes on the sheet
- I2C Serial ID EEPROM
- CH0 I2C line pull-up's.
- Engineer
- All Rights are reserved to Customer and Engineer. [2021]
- Size:
- Date:
- A4
- Project :
- Time:
- Sheet
- of
- Customer
- Product ID
- Module ID
- Version
- File:
- Revision

### Library data of the parts
C135 = Capacitor - 100nF [0402-6V3]: as C83 on sheet Buzzer; Height: 0.25mm; ComponentLink1Description: Mouser; ComponentLink1URL: https://www.mouser.com.tr/ProductDetail/AVX/04026D104KAT4A?qs=sGAEpiMZZMs0AnBnWHyRQPg4iYkCw7IMED%2F4kpqgf7w%3D; ComponentLink2Description: DataSheet; ComponentLink2URL: https://www.mouser.com.tr/datasheet/2/40/cx5r-776519.pdf; ROHS: Yes; Maximum Operating Temperature: +85; Minimum Operating Temperature: -55; Supplier 1: Avnet; Supplier Part Number 1: 04026D104KAT4A; Mouser Part Number: 581-04026D104KAT4A
R58 R59 = Resistor - 10K: as R38-R41 on sheet SD Card; Height: 0.4mm; ComponentLink1Description: DataSheet; ComponentLink1URL: https://www.mouser.com.tr/datasheet/2/427/dcrcwe3-1762152.pdf; ComponentLink2Description: Mouser; ComponentLink2URL: https://www.mouser.com.tr/ProductDetail/Vishay-Dale/CRCW040210K0FKED?qs=sGAEpiMZZMu61qfTUdNhG2DpbjADlD3GcalbOv9utCY%3D; Supplier 1: Mouser; Supplier 2: Digi-Key; Supplier Part Number 1: 71-CRCW040210K0FKEDH; Supplier Part Number 2: 541-10.0KYCT-ND; Mouser Part Number: 71-CRCW0402-10K-E3
U18 = IC - DS28CM00R-A00+T: Security ICs / Authentication ICs I C/SMBus Silicon Serial Number; Case: SOT-23-5; RoHS: Yes; ComponentLink1Description: DataSheet; ComponentLink1URL: https://www.mouser.com.tr/datasheet/2/256/DS28CM00-1514106.pdf; ComponentLink2Description: Mouser; ComponentLink2URL: https://www.mouser.com.tr/ProductDetail/Maxim-Integrated/DS28CM00R-A00%2bT/?qs=0Y9aZN%252BMVCUcpogu0Fss%2Fg%3D%3D; Supplier 1: RSComponents; Supplier 2: Mouser; Supplier 3: Future Electronics; Supplier 4: Farnell; Supplier 5: Newark; Supplier 6: Digi-Key; Supplier 7: Digi-Key; Supplier 8: Digi-Key; Supplier Part Number 1: 1904836; Supplier Part Number 2: 700-DS28CM00R-A00T; Supplier Part Number 4: 2514574; Supplier Part Number 5: 73Y1608; Supplier Part Number 6: DS28CM00R-A00+TCT-ND; Supplier Part Number 7: DS28CM00R-A00+TDKR-ND; Supplier Part Number 8: DS28CM00R-A00+TTR-ND; Supplier Part Number 3: 5092122; Mouser Part Number: 700-DS28CM00R-A00T

## Sheet EEPROM.SchDoc: I2C EEprom
size A4; ApprovedBy: Mehmet Günce Akkoyun; CheckedBy: Mehmet Günce Akkoyun; Author: Mehmet Günce Akkoyun; CompanyName: Ovoo Electronics; DrawnBy: Mehmet Günce Akkoyun; Engineer: Mehmet Günce Akkoyun; Organization: Ovoo Electronics; Address1: Necip Fazıl Mah. Ortaırmak Sok.; Address2: Birgül Apt. No: 19/6; Address3: Meram / Konya; Address4: Turkiye; DocumentNumber: 53; Revision: R06; SheetNumber: 53; SheetTotal: 54
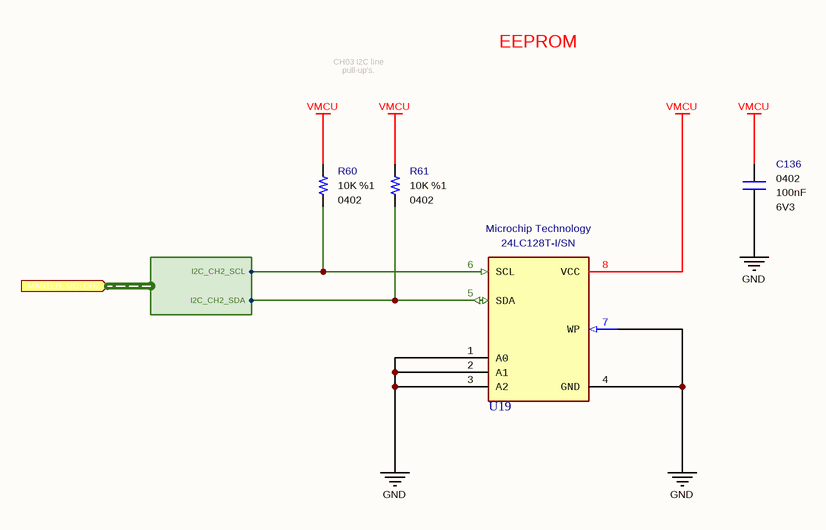
[diagram p61: EEPROM.SchDoc]

### Parts
C136  value 100nF  Case: 0402  Voltage: 6V3  [CAPACITOR_0402]  (hidden comment: Multilayer Ceramic Capacitor)
R60  value 10K  Tolerance: %1  Case: 0402  [RESISTOR_0402]  (hidden comment: Thick Film Resistor)
R61  value 10K  Tolerance: %1  Case: 0402  [RESISTOR_0402]  (hidden comment: Thick Film Resistor)
U19  Manufacturer Part Number: 24LC128T-I/SN  Manufacturer Name: Microchip Technology  [SOIC-8]  (hidden comment: EEPROM)

### Ports
MASTER_I2C_CH2 (in, harness MASTER_I2C_CH2)

### Harnesses
MASTER_I2C_CH2: I2C_CH2_SDA, I2C_CH2_SCL

### Nets
GND: C136.1 U19.1(A0) U19.2(A1) U19.3(A2) U19.4(GND) U19.7(WP)
VMCU: C136.2 R60.2 R61.2 U19.8(VCC)
NetR60_1: R60.1 U19.6(SCL) ; port MASTER_I2C_CH2.I2C_CH2_SCL
NetR61_1: R61.1 U19.5(SDA) ; port MASTER_I2C_CH2.I2C_CH2_SDA

### Notes on the sheet
- EEPROM
- CH03 I2C line pull-up's.
- Engineer
- All Rights are reserved to Customer and Engineer. [2021]
- Size:
- Date:
- A4
- Project :
- Time:
- Sheet
- of
- Customer
- Product ID
- Module ID
- Version
- File:
- Revision

### Library data of the parts
C136 = Capacitor - 100nF [0402-6V3]: as C83 on sheet Buzzer; Height: 0.25mm; ComponentLink1Description: Mouser; ComponentLink1URL: https://www.mouser.com.tr/ProductDetail/AVX/04026D104KAT4A?qs=sGAEpiMZZMs0AnBnWHyRQPg4iYkCw7IMED%2F4kpqgf7w%3D; ComponentLink2Description: DataSheet; ComponentLink2URL: https://www.mouser.com.tr/datasheet/2/40/cx5r-776519.pdf; ROHS: Yes; Maximum Operating Temperature: +85; Minimum Operating Temperature: -55; Supplier 1: Avnet; Supplier Part Number 1: 04026D104KAT4A; Mouser Part Number: 581-04026D104KAT4A
R60 R61 = Resistor - 10K: as R38-R41 on sheet SD Card; Height: 0.4mm; ComponentLink1Description: DataSheet; ComponentLink1URL: https://www.mouser.com.tr/datasheet/2/427/dcrcwe3-1762152.pdf; ComponentLink2Description: Mouser; ComponentLink2URL: https://www.mouser.com.tr/ProductDetail/Vishay-Dale/CRCW040210K0FKED?qs=sGAEpiMZZMu61qfTUdNhG2DpbjADlD3GcalbOv9utCY%3D; Supplier 1: Mouser; Supplier 2: Digi-Key; Supplier Part Number 1: 71-CRCW040210K0FKEDH; Supplier Part Number 2: 541-10.0KYCT-ND; Mouser Part Number: 71-CRCW0402-10K-E3
U19 = IC - 24LC128: Case: SOIC-8; RoHS: Yes; ComponentLink1Description: DataSheet; ComponentLink1URL: https://www.mouser.com.tr/datasheet/2/256/DS28CM00-1514106.pdf; ComponentLink2Description: Mouser; ComponentLink2URL: https://www.mouser.com.tr/ProductDetail/Maxim-Integrated/DS28CM00R-A00%2bT/?qs=0Y9aZN%252BMVCUcpogu0Fss%2Fg%3D%3D; Mouser Part Number: 579-24LC128T-I/SN; Supplier 1: Avnet; Supplier 2: Future Electronics; Supplier 3: Arrow Electronics; Supplier 4: Mouser; Supplier 5: Farnell; Supplier 6: Newark; Supplier 7: Digi-Key; Supplier 8: Digi-Key; Supplier Part Number 1: 24LC128T-I/SN; Supplier Part Number 2: 4391603; Supplier Part Number 3: 24LC128T-I/SN; Supplier Part Number 4: 579-24LC128T-I/SN; Supplier Part Number 5: 1296574; Supplier Part Number 6: 25M1950; Supplier Part Number 7: 24LC128T-I/SNCT-ND; Supplier Part Number 8: 24LC128T-I/SNDKR-ND

## Sheet Analog Digital Converter.SchDoc: Analog Digital Converter
size A4; ApprovedBy: Mehmet Günce Akkoyun; CheckedBy: Mehmet Günce Akkoyun; Author: Mehmet Günce Akkoyun; CompanyName: Ovoo Electronics; DrawnBy: Mehmet Günce Akkoyun; Engineer: Mehmet Günce Akkoyun; Organization: Ovoo Electronics; Address1: Necip Fazıl Mah. Ortaırmak Sok.; Address2: Birgül Apt. No: 19/6; Address3: Meram / Konya; Address4: Turkiye; DocumentNumber: 54; Revision: R06; SheetNumber: 54; SheetTotal: 54
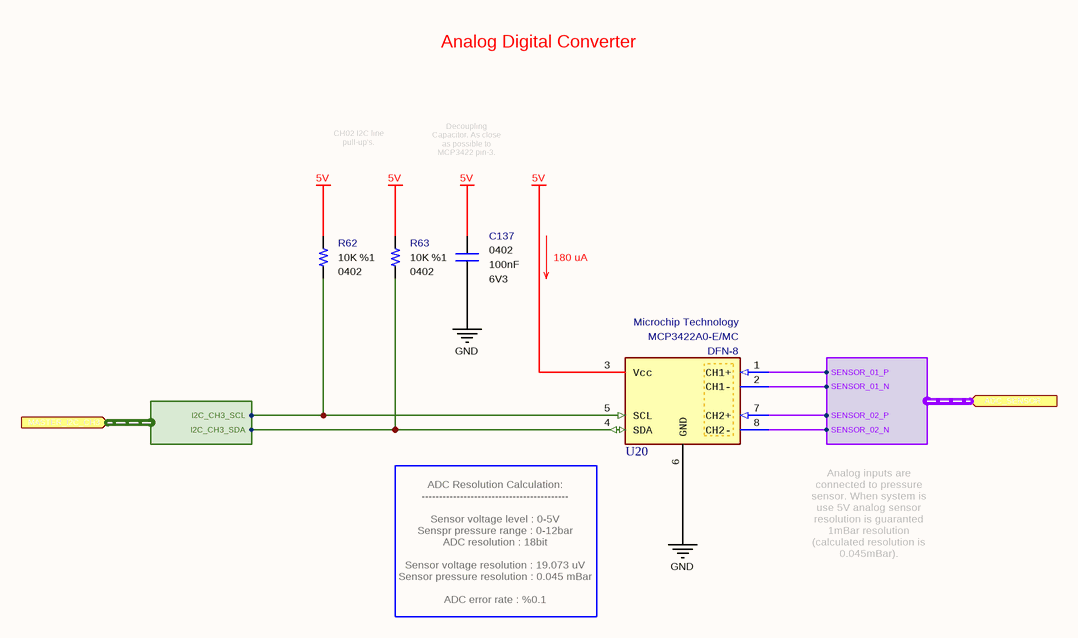
[diagram p62: Analog Digital Converter.SchDoc]

### Parts
C137  value 100nF  Case: 0402  Voltage: 6V3  [CAPACITOR_0402]  (hidden comment: Multilayer Ceramic Capacitor)
R62  value 10K  Tolerance: %1  Case: 0402  [RESISTOR_0402]  (hidden comment: Thick Film Resistor)
R63  value 10K  Tolerance: %1  Case: 0402  [RESISTOR_0402]  (hidden comment: Thick Film Resistor)
U20  Manufacturer Part Number: MCP3422A0-E/MC  Manufacturer Name: Microchip Technology  [DFN-8]  (hidden comment: Analog to Digital Converters - ADC)

### Ports
ADC_SENSOR (in, harness ADC_SENSOR), MASTER_I2C_CH3 (in, harness MASTER_I2C_CH3)

### Harnesses
MASTER_I2C_CH3: I2C_CH3_SDA, I2C_CH3_SCL
ADC_SENSOR: SENSOR_01_P, SENSOR_01_N, SENSOR_02_P, SENSOR_02_N

### Nets
5V: C137.2 R62.2 R63.2 U20.3(Vcc)
GND: C137.1 U20.6(GND)
NetC216_2: U20.8(CH2-) ; port ADC_SENSOR.SENSOR_02_N
NetC217_2: U20.7(CH2+) ; port ADC_SENSOR.SENSOR_02_P
NetC218_2: U20.2(CH1-) ; port ADC_SENSOR.SENSOR_01_N
NetC219_2: U20.1(CH1+) ; port ADC_SENSOR.SENSOR_01_P
NetR62_1: R62.1 U20.5(SCL) ; port MASTER_I2C_CH3.I2C_CH3_SCL
NetR63_1: R63.1 U20.4(SDA) ; port MASTER_I2C_CH3.I2C_CH3_SDA

### Notes on the sheet
- Analog Digital Converter
- CH02 I2C line pull-up's.
- Decoupling Capacitor. As close as possible to MCP3422 pin-3.
- 180 uA
- Analog inputs are connected to pressure sensor. When system is use 5V analog sensor resolution is guaranted 1mBar resolution (calculated resolution is 0.045mBar).
- (near U20) ADC Resolution Calculation:
  ------------------------------------------
  Sensor voltage level : 0-5V
  Senspr pressure range : 0-12bar
  ADC resolution : 18bit
  Sensor voltage resolution : 19.073 uV
  Sensor pressure resolution : 0.045 mBar
  ADC error rate : %0.1
- Title
- Size:
- Date:
- A4
- Number:
- Time:
- Revision:
- Sheet
- of
- File:

### Library data of the parts
C137 = Capacitor - 100nF [0402-6V3]: as C83 on sheet Buzzer; Height: 0.25mm; ComponentLink1Description: Mouser; ComponentLink1URL: https://www.mouser.com.tr/ProductDetail/AVX/04026D104KAT4A?qs=sGAEpiMZZMs0AnBnWHyRQPg4iYkCw7IMED%2F4kpqgf7w%3D; ComponentLink2Description: DataSheet; ComponentLink2URL: https://www.mouser.com.tr/datasheet/2/40/cx5r-776519.pdf; ROHS: Yes; Maximum Operating Temperature: +85; Minimum Operating Temperature: -55; Supplier 1: Avnet; Supplier Part Number 1: 04026D104KAT4A; Mouser Part Number: 581-04026D104KAT4A
R62 R63 = Resistor - 10K: as R38-R41 on sheet SD Card; Height: 0.4mm; ComponentLink1Description: DataSheet; ComponentLink1URL: https://www.mouser.com.tr/datasheet/2/427/dcrcwe3-1762152.pdf; ComponentLink2Description: Mouser; ComponentLink2URL: https://www.mouser.com.tr/ProductDetail/Vishay-Dale/CRCW040210K0FKED?qs=sGAEpiMZZMu61qfTUdNhG2DpbjADlD3GcalbOv9utCY%3D; Supplier 1: Mouser; Supplier 2: Digi-Key; Supplier Part Number 1: 71-CRCW040210K0FKEDH; Supplier Part Number 2: 541-10.0KYCT-ND; Mouser Part Number: 71-CRCW0402-10K-E3
U20 = IC - MCP3422: Analog to Digital Converters - ADC 18B delta-sigma ADC dual Ch 4sps; ComponentLink1Description: DataSheet; ComponentLink1URL: http://www.ti.com/general/docs/suppproductinfo.tsp?distId=26&gotoUrl=http%3A%2F%2Fwww.ti.com%2Flit%2Fgpn%2Ftca9517a; ComponentLink2Description: Mouser; ComponentLink2URL: https://www.mouser.com.tr/ProductDetail/Texas-Instruments/TCA9517ADGKR?qs=%252BrH4t%252BeVZ2M4pVnwXR4oNA==; Minimum Operating Temperature: -40; Maximum Operating Temperature: +125; Supplier 1: Avnet; Supplier 2: Mouser; Supplier 3: Arrow; Supplier 4: Digi-Key; Supplier Part Number 1: MCP3422A0-E/MC; Supplier Part Number 2: 579-MCP3422A0-E/MC; Supplier Part Number 3: MCP3422A0-E/MC; Supplier Part Number 4: MCP3422A0-E/MC-ND; Case: DFN-8; Mouser Part Number: 579-MCP3422A0-E/MC